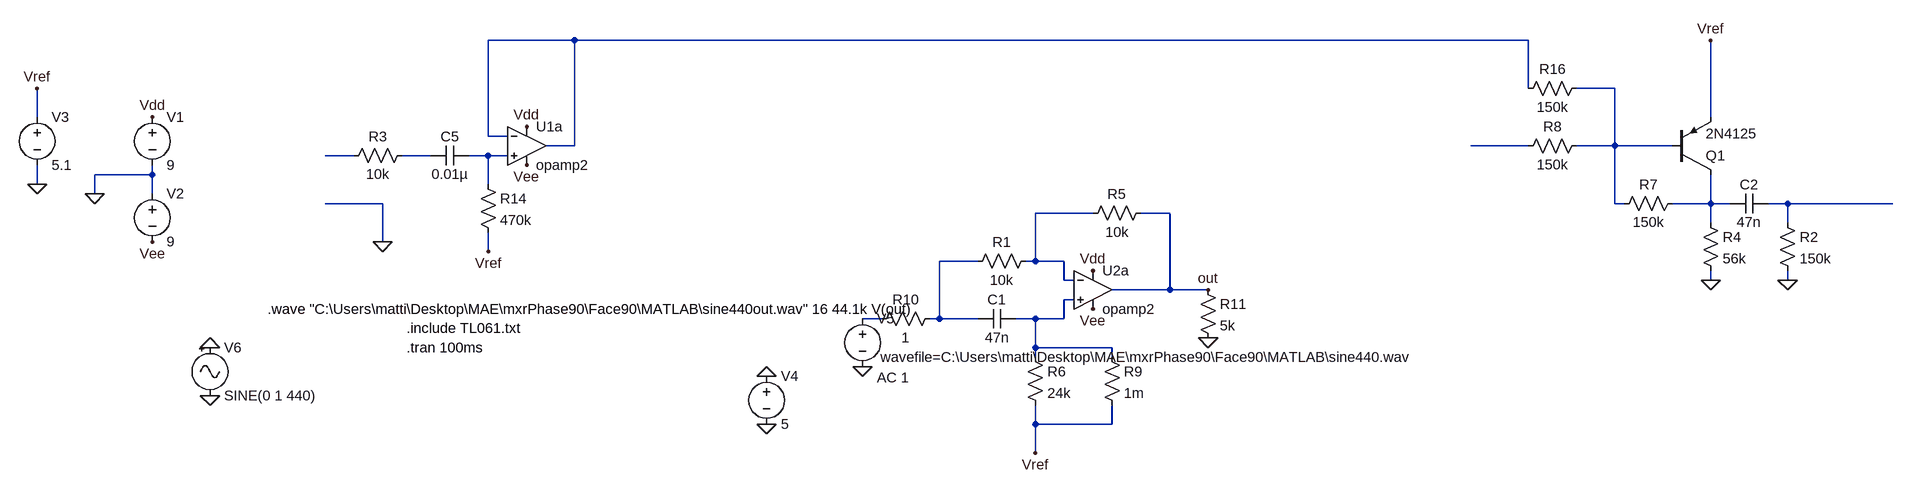
[diagram p0: schematic phase90 - Stage.asc]
phase90 - Stage.asc, the LTspice schematic file:
Version 4
SHEET 1 3572 1140
WIRE 720 48 576 48
WIRE 2720 48 720 48
WIRE 2720 128 2720 48
WIRE 2864 128 2800 128
WIRE -176 176 -176 128
WIRE 3024 176 3024 48
WIRE 576 208 576 48
WIRE 608 208 576 208
WIRE 720 224 720 48
WIRE 720 224 672 224
WIRE 2720 224 2624 224
WIRE 2864 224 2864 128
WIRE 2864 224 2800 224
WIRE 2960 224 2864 224
WIRE 352 240 304 240
WIRE 480 240 432 240
WIRE 576 240 544 240
WIRE 608 240 576 240
WIRE 16 272 16 256
WIRE 16 272 -80 272
WIRE -176 288 -176 256
WIRE 576 288 576 240
WIRE -80 304 -80 272
WIRE 16 304 16 272
WIRE 400 320 304 320
WIRE 2864 320 2864 224
WIRE 2880 320 2864 320
WIRE 3024 320 3024 272
WIRE 3024 320 2960 320
WIRE 3056 320 3024 320
WIRE 3152 320 3120 320
WIRE 3456 320 3152 320
WIRE 1584 336 1488 336
WIRE 1712 336 1664 336
WIRE 3024 352 3024 320
WIRE 3152 352 3152 320
WIRE 400 384 400 320
WIRE 576 400 576 368
WIRE 1392 416 1328 416
WIRE 1488 416 1488 336
WIRE 1488 416 1472 416
WIRE 1536 416 1488 416
WIRE 1536 448 1536 416
WIRE 1552 448 1536 448
WIRE 3024 448 3024 432
WIRE 3152 448 3152 432
WIRE 1712 464 1712 336
WIRE 1712 464 1616 464
WIRE 1776 464 1712 464
WIRE 1552 480 1536 480
WIRE 1232 512 1200 512
WIRE 1328 512 1328 416
WIRE 1328 512 1312 512
WIRE 1392 512 1328 512
WIRE 1488 512 1456 512
WIRE 1536 512 1536 480
WIRE 1536 512 1488 512
WIRE 1488 560 1488 512
WIRE 1616 560 1488 560
WIRE 1488 576 1488 560
WIRE 1616 576 1616 560
WIRE 1488 688 1488 656
WIRE 1616 688 1616 656
WIRE 1616 688 1488 688
WIRE 1488 736 1488 688
FLAG -80 304 0
FLAG 16 176 Vdd
FLAG 16 384 Vee
FLAG -176 288 0
FLAG -176 128 Vref
FLAG 576 400 Vref
FLAG 400 384 0
FLAG 1488 736 Vref
FLAG 3024 48 Vref
FLAG 3024 448 0
FLAG 3152 448 0
FLAG 640 192 Vdd
FLAG 1584 432 Vdd
FLAG 640 256 Vee
FLAG 1584 496 Vee
FLAG 1776 464 out
FLAG 112 640 0
FLAG 112 560 0
FLAG 1776 544 0
FLAG 1200 592 0
FLAG 1040 688 0
FLAG 1040 608 0
SYMBOL voltage 16 160 R0
WINDOW 123 0 0 Left 0
WINDOW 39 0 0 Left 0
SYMATTR InstName V1
SYMATTR Value 9
SYMBOL voltage 16 288 R0
WINDOW 123 0 0 Left 0
WINDOW 39 0 0 Left 0
SYMATTR InstName V2
SYMATTR Value 9
SYMBOL OpAmps\\opamp2 640 160 R0
SYMATTR InstName U1a
SYMBOL cap 544 224 R90
WINDOW 0 0 32 VBottom 2
WINDOW 3 32 32 VTop 2
SYMATTR InstName C5
SYMATTR Value 0.01µ
SYMBOL res 448 224 R90
WINDOW 0 0 56 VBottom 2
WINDOW 3 32 56 VTop 2
SYMATTR InstName R3
SYMATTR Value 10k
SYMBOL res 560 272 R0
SYMATTR InstName R14
SYMATTR Value 470k
SYMBOL voltage -176 160 R0
SYMATTR InstName V3
SYMATTR Value 5.1
SYMBOL res 1488 400 R90
WINDOW 0 0 56 VBottom 2
WINDOW 3 32 56 VTop 2
SYMATTR InstName R1
SYMATTR Value 10k
SYMBOL OpAmps\\opamp2 1584 400 R0
SYMATTR InstName U2a
SYMBOL res 1472 560 R0
SYMATTR InstName R6
SYMATTR Value 24k
SYMBOL res 1680 320 R90
WINDOW 0 0 56 VBottom 2
WINDOW 3 32 56 VTop 2
SYMATTR InstName R5
SYMATTR Value 10k
SYMBOL res 2816 208 R90
WINDOW 0 0 56 VBottom 2
WINDOW 3 32 56 VTop 2
SYMATTR InstName R8
SYMATTR Value 150k
SYMBOL res 2816 112 R90
WINDOW 0 0 56 VBottom 2
WINDOW 3 32 56 VTop 2
SYMATTR InstName R16
SYMATTR Value 150k
SYMBOL res 2976 304 R90
WINDOW 0 0 56 VBottom 2
WINDOW 3 32 56 VTop 2
SYMATTR InstName R7
SYMATTR Value 150k
SYMBOL pnp 2960 272 M180
SYMATTR InstName Q1
SYMATTR Value 2N4125
SYMBOL cap 3120 304 R90
WINDOW 0 0 32 VBottom 2
WINDOW 3 32 32 VTop 2
SYMATTR InstName C2
SYMATTR Value 47n
SYMBOL res 3008 336 R0
SYMATTR InstName R4
SYMATTR Value 56k
SYMBOL res 3136 336 R0
SYMATTR InstName R2
SYMATTR Value 150k
SYMBOL voltage 1200 496 R0
WINDOW 123 24 114 Left 2
WINDOW 39 0 0 Left 0
WINDOW 3 30 80 Left 2
SYMATTR Value2 AC 1
SYMATTR Value wavefile=C:\Users\matti\Desktop\MAE\mxrPhase90\Face90\MATLAB\sine440.wav
SYMATTR InstName V5
SYMBOL Misc\\signal 112 544 R0
WINDOW 123 0 0 Left 0
WINDOW 39 0 0 Left 0
SYMATTR InstName V6
SYMATTR Value SINE(0 1 440)
SYMBOL res 1600 560 R0
SYMATTR InstName R9
SYMATTR Value 1m
SYMBOL res 1760 448 R0
SYMATTR InstName R11
SYMATTR Value 5k
SYMBOL voltage 1040 592 R0
SYMATTR InstName V4
SYMATTR Value 5
SYMBOL cap 1456 496 R90
WINDOW 0 0 32 VBottom 2
WINDOW 3 32 32 VTop 2
SYMATTR InstName C1
SYMATTR Value 47n
SYMBOL res 1328 496 R90
WINDOW 0 0 56 VBottom 2
WINDOW 3 32 56 VTop 2
SYMATTR InstName R10
SYMATTR Value 1
TEXT 440 528 Left 2 !.include TL061.txt
TEXT 440 560 Left 2 !.tran 100ms
TEXT 208 496 Left 2 !.wave "C:\\Users\\matti\\Desktop\\MAE\\mxrPhase90\\Face90\\MATLAB\\sine440out.wav" 16 44.1k V(out)

The netlist it stands for:
* phase90 - Stage.asc
V1 Vdd 0 9
V2 0 Vee 9
XU1a N006 N001 Vdd Vee N001 opamp2  ; pins In+ In- V+ V- OUT
C5 N006 N005 0.01µ
R3 N005 N004 10k
R14 N006 Vref 470k
V3 Vref 0 5.1
R1 N009 N010 10k
XU2a N011 N009 Vdd Vee out opamp2  ; pins In+ In- V+ V- OUT
R6 N011 Vref 24k
R5 out N009 10k
R8 N002 N003 150k
R16 N002 N001 150k
R7 N007 N002 150k
Q1 N007 N002 Vref 0 2N4125
C2 N008 N007 47n
R4 N007 0 56k
R2 N008 0 150k
V5 N012 0 wavefile=C:\Users\matti\Desktop\MAE\mxrPhase90\Face90\MATLAB\sine440.wav AC 1
V6 0 0 SINE(0 1 440)
R9 N011 Vref 1m
R11 out 0 5k
V4 0 0 5
C1 N011 N010 47n
R10 N010 N012 1
.model NPN NPN
.model PNP PNP
.lib standard.bjt
.include TL061.txt
.tran 100ms
.wave "C:\Users\matti\Desktop\MAE\mxrPhase90\Face90\MATLAB\sine440out.wav" 16 44.1k V(out)
.backanno
.end